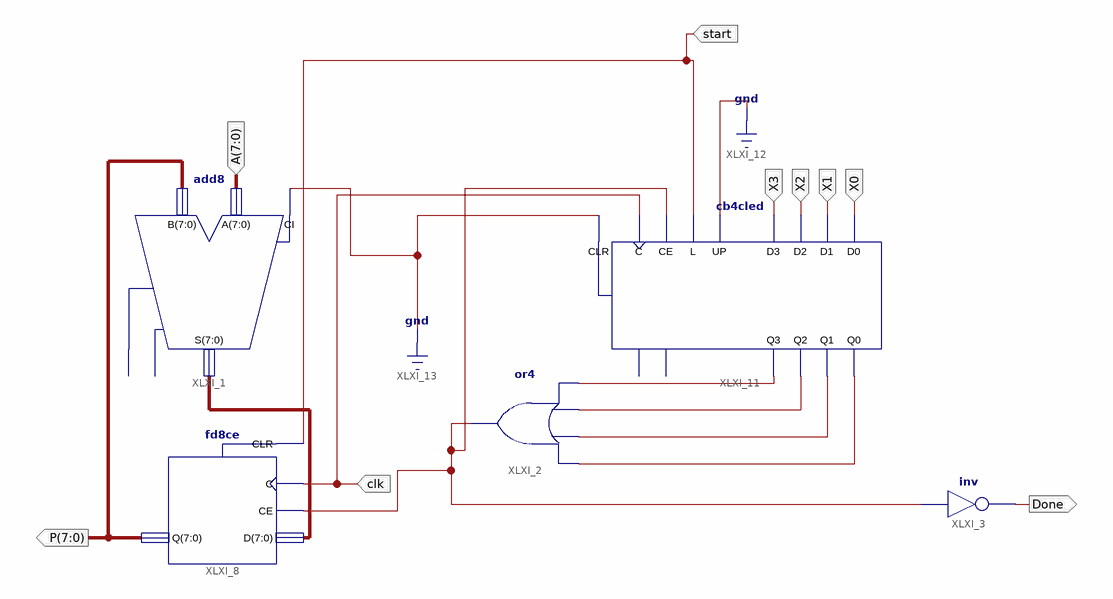
[diagram p0: schematic sheet 1]
// Xilinx ISE schematic MultiSim.sch (spartan6) as structural Verilog: 5 symbols, 9 ports
module MultiSim (
  input  [7:0] A,
  input  clk,
  input  start,
  input  X3,
  input  X2,
  input  X1,
  input  X0,
  output Done,
  output [7:0] P
);

  wire XLXN_18, XLXN_19, XLXN_20, XLXN_21, XLXN_24;
  wire [7:0] XLXN_14;

  add8 XLXI_1 (.A(A), .B(P), .CI(1'b0), .S(XLXN_14));  // open: CO, OFL
  or XLXI_2 (XLXN_24, XLXN_18, XLXN_19, XLXN_20, XLXN_21);
  not XLXI_3 (Done, XLXN_24);
  fd8ce XLXI_8 (.C(clk), .CE(XLXN_24), .CLR(start), .D(XLXN_14), .Q(P));
  cb4cled XLXI_11 (
    .C(clk), .CE(XLXN_24), .CLR(1'b0), .D0(X0), .D1(X1), .D2(X2), .D3(X3), .L(start), .UP(1'b0),
    .Q0(XLXN_21), .Q1(XLXN_20), .Q2(XLXN_19), .Q3(XLXN_18));  // open: CEO, TC
endmodule
